# EAGLE design addressing-manual-gnd (EAGLE 7.7.0)
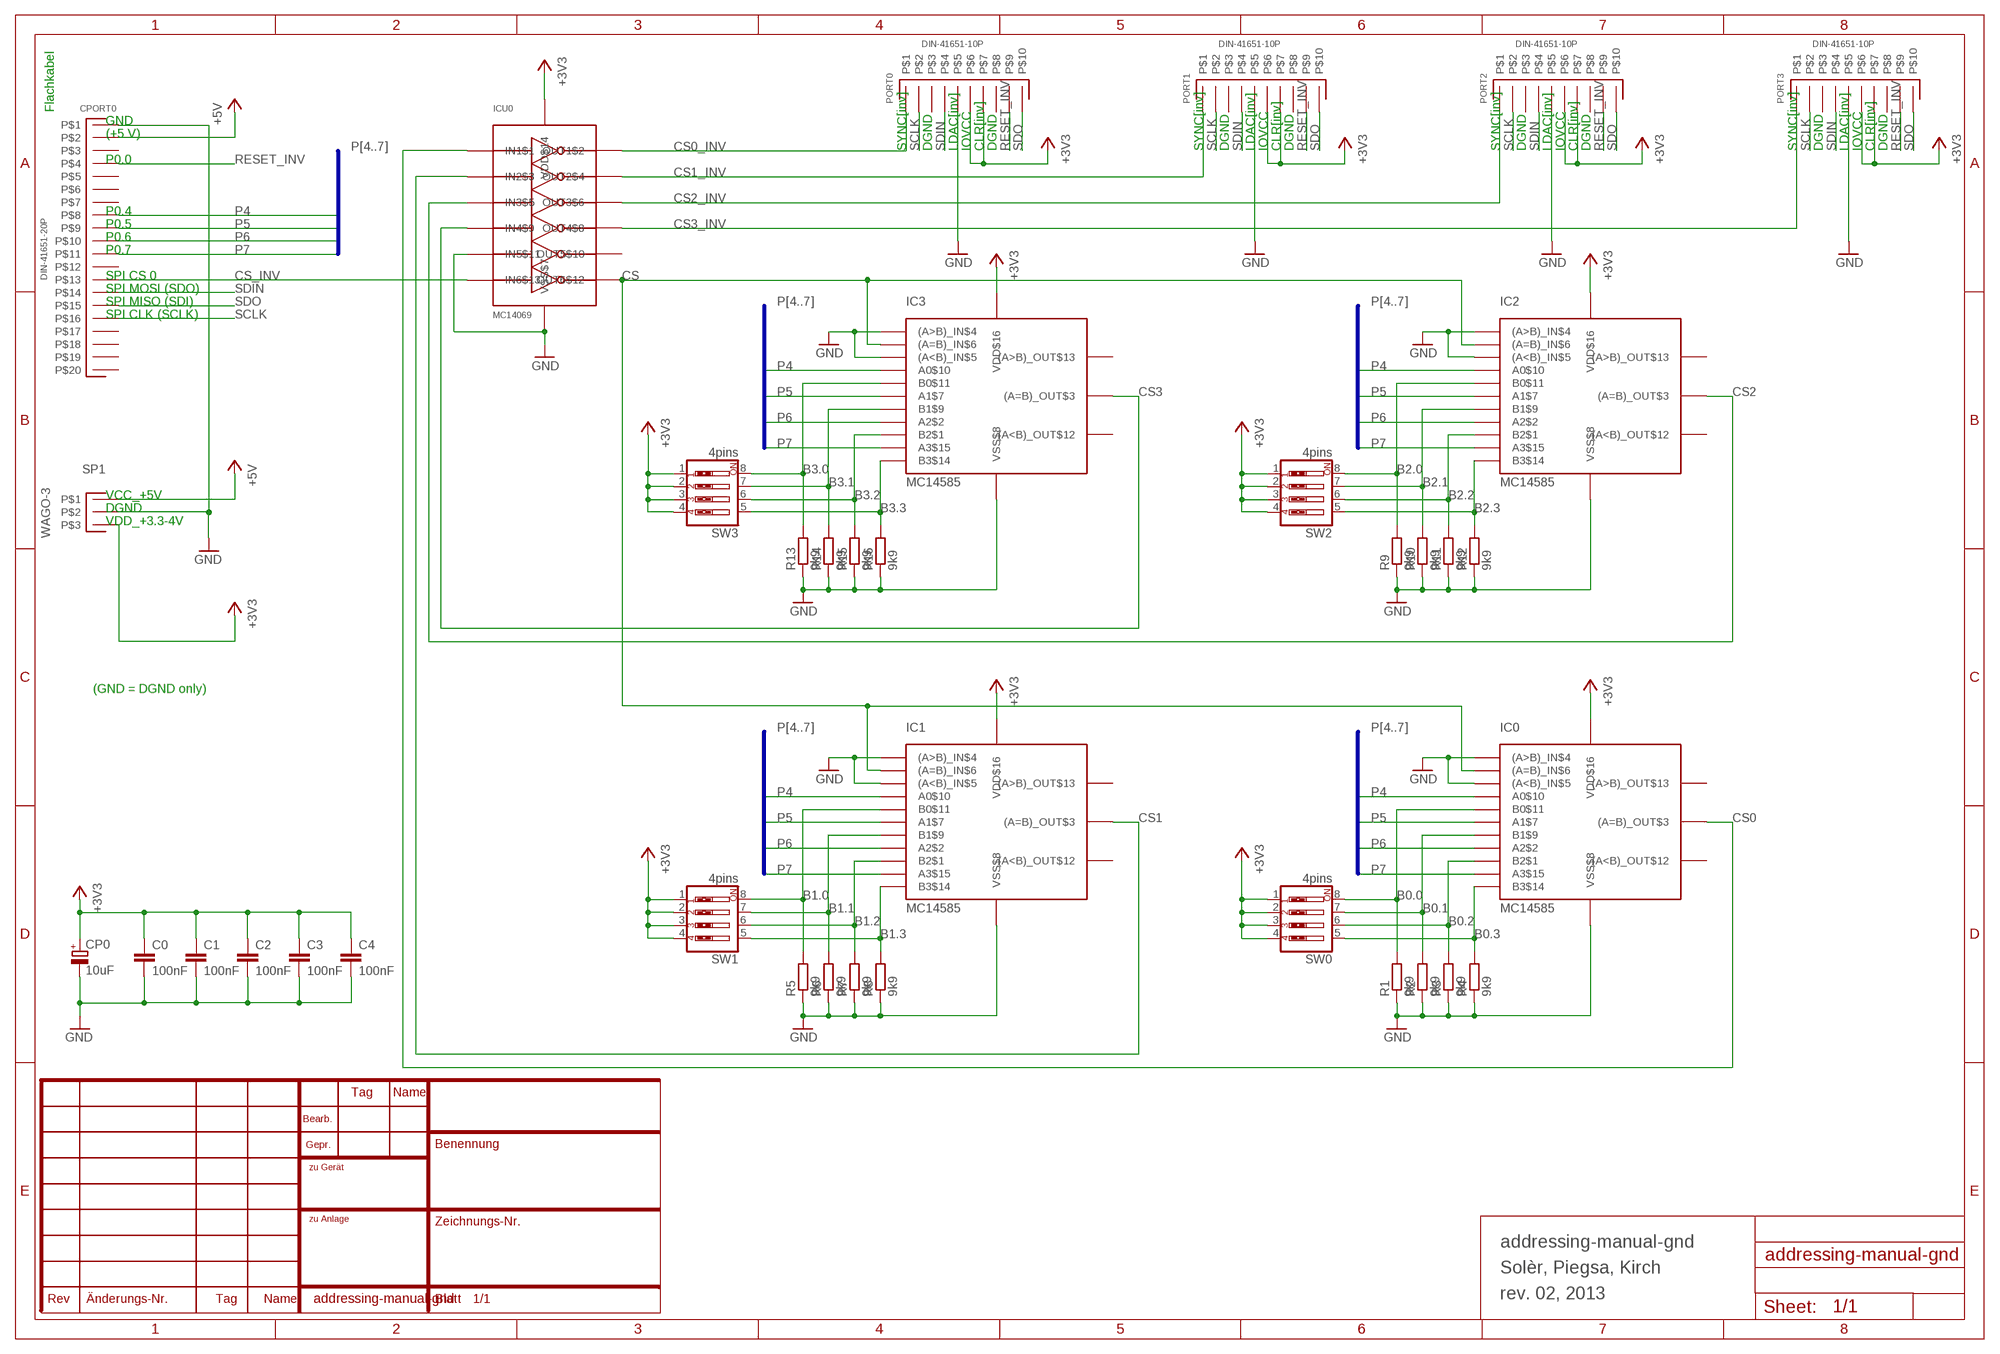
[diagram p0: schematic, sheet 1]

## Parts
C0  100nF  C-EU050-025X075  [C050-025X075]
C1  100nF  C-EU050-025X075  [C050-025X075]
C2  100nF  C-EU050-025X075  [C050-025X075]
C3  100nF  C-EU050-025X075  [C050-025X075]
C4  100nF  C-EU050-025X075  [C050-025X075]
CP0  10uF  CPOL-EUB45181B  [B45181B]
CPORT0  DIN-41651-20P  [DIN-41651-20P]
IC0  MC14585  [PDIP-16]
IC1  MC14585  [PDIP-16]
IC2  MC14585  [PDIP-16]
IC3  MC14585  [PDIP-16]
ICU0  MC14069  [PDIP-14]
PORT0  DIN-41651-10P  [DIN-41651-10P]
PORT1  DIN-41651-10P  [DIN-41651-10P]
PORT2  DIN-41651-10P  [DIN-41651-10P]
PORT3  DIN-41651-10P  [DIN-41651-10P]
R1  9k9  R-EU_0207/12  [0207/12]
R2  9k9  R-EU_0207/12  [0207/12]
R3  9k9  R-EU_0207/12  [0207/12]
R4  9k9  R-EU_0207/12  [0207/12]
R5  9k9  R-EU_0207/12  [0207/12]
R6  9k9  R-EU_0207/12  [0207/12]
R7  9k9  R-EU_0207/12  [0207/12]
R8  9k9  R-EU_0207/12  [0207/12]
R9  9k9  R-EU_0207/12  [0207/12]
R10  9k9  R-EU_0207/12  [0207/12]
R11  9k9  R-EU_0207/12  [0207/12]
R12  9k9  R-EU_0207/12  [0207/12]
R13  9k9  R-EU_0207/12  [0207/12]
R14  9k9  R-EU_0207/12  [0207/12]
R15  9k9  R-EU_0207/12  [0207/12]
R16  9k9  R-EU_0207/12  [0207/12]
SP1  WAGO-3  [WAGO-3]
SW0  4pins  SW_DIP-4  [EDG-04]
SW1  4pins  SW_DIP-4  [EDG-04]
SW2  4pins  SW_DIP-4  [EDG-04]
SW3  4pins  SW_DIP-4  [EDG-04]

## Nets
+3V3: C0.1 C1.1 C2.1 C3.1 C4.1 CP0.+ IC0.VDD$16 IC1.VDD$16 IC2.VDD$16 IC3.VDD$16 ICU0.VDD$14 PORT0.P$6 PORT0.P$7 PORT1.P$6 PORT1.P$7 PORT2.P$6 PORT2.P$7 PORT3.P$6 PORT3.P$7 SP1.P$3 SW0.1 SW0.2 SW0.3 SW0.4 SW1.1 SW1.2 SW1.3 SW1.4 SW2.1 SW2.2 SW2.3 SW2.4 SW3.1 SW3.2 SW3.3 SW3.4
+5V: CPORT0.P$2 SP1.P$1
B0.0: IC0.B0$11 R1.2 SW0.8
B0.1: IC0.B1$9 R2.2 SW0.7
B0.2: IC0.B2$1 R3.2 SW0.6
B0.3: IC0.B3$14 R4.2 SW0.5
B1.0: IC1.B0$11 R5.2 SW1.8
B1.1: IC1.B1$9 R6.2 SW1.7
B1.2: IC1.B2$1 R7.2 SW1.6
B1.3: IC1.B3$14 R8.2 SW1.5
B2.0: IC2.B0$11 R9.2 SW2.8
B2.1: IC2.B1$9 R10.2 SW2.7
B2.2: IC2.B2$1 R11.2 SW2.6
B2.3: IC2.B3$14 R12.2 SW2.5
B3.0: IC3.B0$11 R13.2 SW3.8
B3.1: IC3.B1$9 R14.2 SW3.7
B3.2: IC3.B2$1 R15.2 SW3.6
B3.3: IC3.B3$14 R16.2 SW3.5
CS: IC0.(A=B)_IN$6 IC1.(A=B)_IN$6 IC2.(A=B)_IN$6 IC3.(A=B)_IN$6 ICU0.OUT6$12
CS0: IC0.(A=B)_OUT$3 ICU0.IN1$1
CS0_INV: ICU0.OUT1$2 PORT0.P$1
CS1: IC1.(A=B)_OUT$3 ICU0.IN2$3
CS1_INV: ICU0.OUT2$4 PORT1.P$1
CS2: IC2.(A=B)_OUT$3 ICU0.IN3$5
CS2_INV: ICU0.OUT3$6 PORT2.P$1
CS3: IC3.(A=B)_OUT$3 ICU0.IN4$9
CS3_INV: ICU0.OUT4$8 PORT3.P$1
CS_INV: CPORT0.P$13 ICU0.IN6$13
GND: C0.2 C1.2 C2.2 C3.2 C4.2 CP0.- CPORT0.P$1 IC0.(A<B)_IN$5 IC0.(A>B)_IN$4 IC0.VSS$8 IC1.(A<B)_IN$5 IC1.(A>B)_IN$4 IC1.VSS$8 IC2.(A<B)_IN$5 IC2.(A>B)_IN$4 IC2.VSS$8 IC3.(A<B)_IN$5 IC3.(A>B)_IN$4 IC3.VSS$8 ICU0.IN5$11 ICU0.VSS$7 PORT0.P$5 PORT1.P$5 PORT2.P$5 PORT3.P$5 R1.1 R2.1 R3.1 R4.1 R5.1 R6.1 R7.1 R8.1 R9.1 R10.1 R11.1 R12.1 R13.1 R14.1 R15.1 R16.1 SP1.P$2
P4: CPORT0.P$8 IC0.A0$10 IC1.A0$10 IC2.A0$10 IC3.A0$10
P5: CPORT0.P$9 IC0.A1$7 IC1.A1$7 IC2.A1$7 IC3.A1$7
P6: CPORT0.P$10 IC0.A2$2 IC1.A2$2 IC2.A2$2 IC3.A2$2
P7: CPORT0.P$11 IC0.A3$15 IC1.A3$15 IC2.A3$15 IC3.A3$15
RESET_INV: CPORT0.P$4 PORT0.P$9 PORT1.P$9 PORT2.P$9 PORT3.P$9
SCLK: CPORT0.P$16 PORT0.P$2 PORT1.P$2 PORT2.P$2 PORT3.P$2
SDIN: CPORT0.P$14 PORT0.P$4 PORT1.P$4 PORT2.P$4 PORT3.P$4
SDO: CPORT0.P$15 PORT0.P$10 PORT1.P$10 PORT2.P$10 PORT3.P$10
Unconnected: CPORT0.P$3 CPORT0.P$5 CPORT0.P$6 CPORT0.P$7 CPORT0.P$12 CPORT0.P$17 CPORT0.P$18 CPORT0.P$19 CPORT0.P$20 IC0.(A<B)_OUT$12 IC0.(A>B)_OUT$13 IC1.(A<B)_OUT$12 IC1.(A>B)_OUT$13 IC2.(A<B)_OUT$12 IC2.(A>B)_OUT$13 IC3.(A<B)_OUT$12 IC3.(A>B)_OUT$13 ICU0.OUT5$10 PORT0.P$3 PORT0.P$8 PORT1.P$3 PORT1.P$8 PORT2.P$3 PORT2.P$8 PORT3.P$3 PORT3.P$8

## Buses
P[4..7]

## Notes on the sheet
- Flachkabel
- GND
- (+5 V)
- SYNC[inv] | DGND | LDAC[inv] | IOVCC | CLR[inv] | DGND | SYNC[inv] | DGND | LDAC[inv] | IOVCC | CLR[inv] | DGND | SYNC[inv] | DGND | LDAC[inv] | IOVCC | CLR[inv] | DGND | SYNC[inv] | DGND | LDAC[inv] | IOVCC | CLR[inv] | DGND
- P0.0
- P0.4
- P0.5
- P0.6
- P0.7
- SPI CS 0
- SPI MOSI (SDO)
- SPI MISO (SDI)
- SPI CLK (SCLK)
- VCC_+5V
- DGND
- VDD_+3.3-4V
- (GND = DGND only)
- addressing-manual-gnd
- Solèr, Piegsa, Kirch
- rev. 02, 2013

## Library data of the parts
C0 C1-C4 = rcl:C-EU: CAPACITOR, European symbol
CP0 = rcl:CPOL-EU: POLARIZED CAPACITOR, European symbol
CPORT0 = parts:DIN-41651-20P
IC0 IC1-IC3 = parts:MC14585
ICU0 = parts:MC14069
PORT0 PORT1-PORT3 = parts:DIN-41651-10P
R1-R16 = rcl:R-EU_: RESISTOR, European symbol
SP1 = parts:WAGO-3
SW0 SW1-SW3 = special:SW_DIP-4: DIP SWITCH

## Board
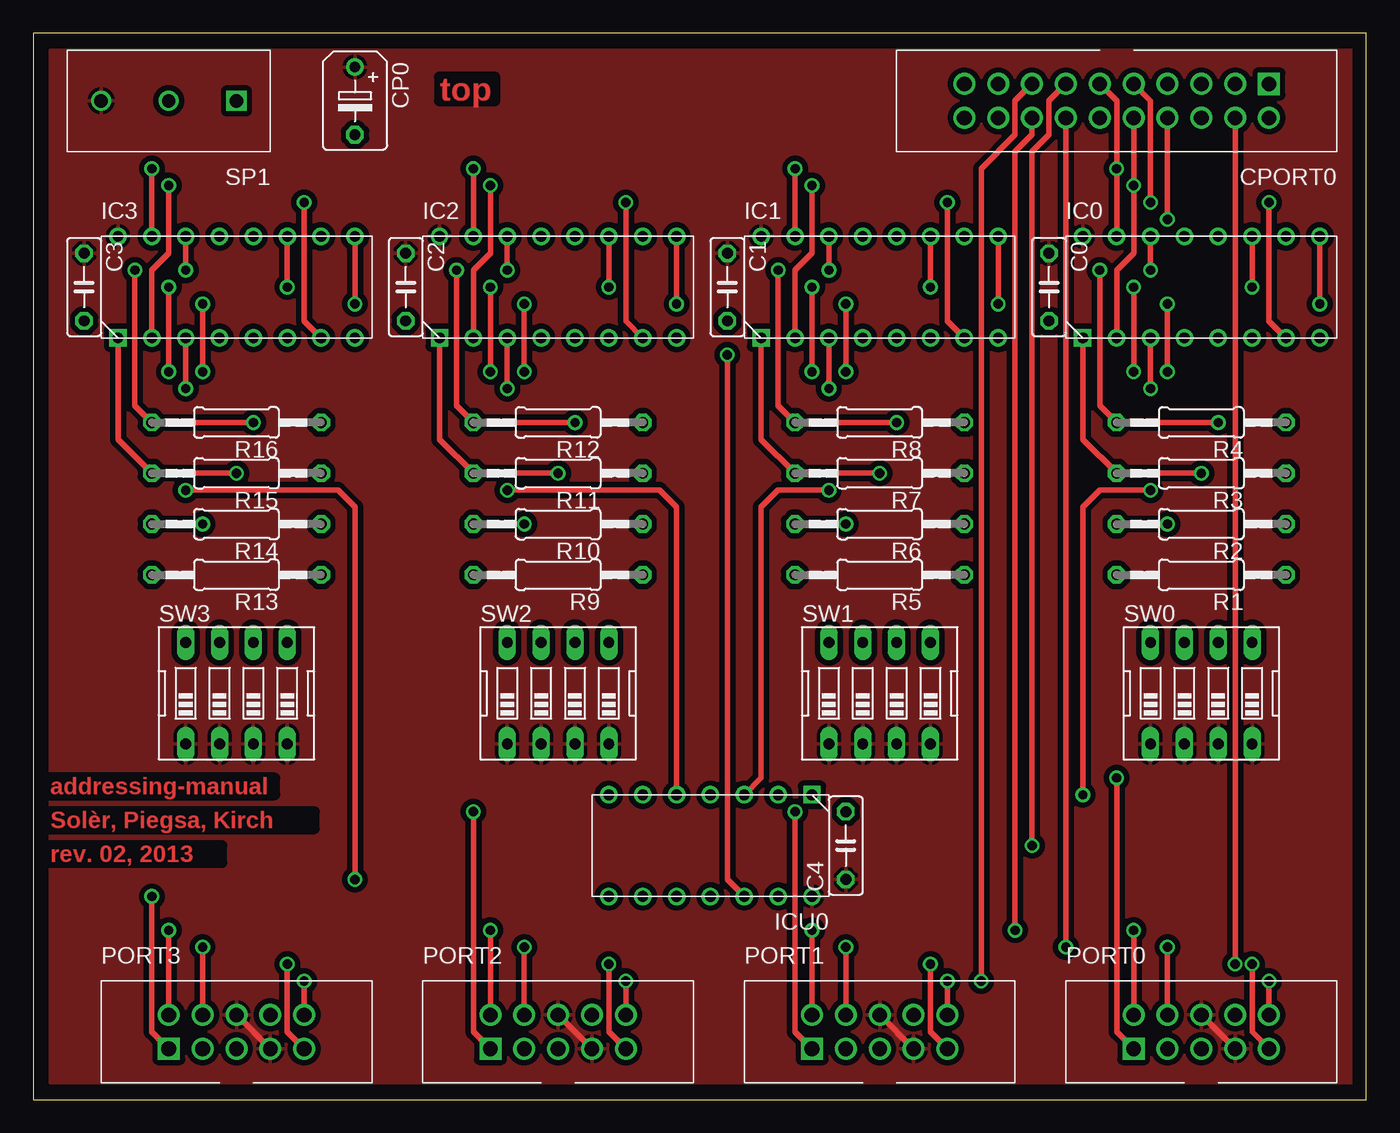
[diagram p1: board, top side]
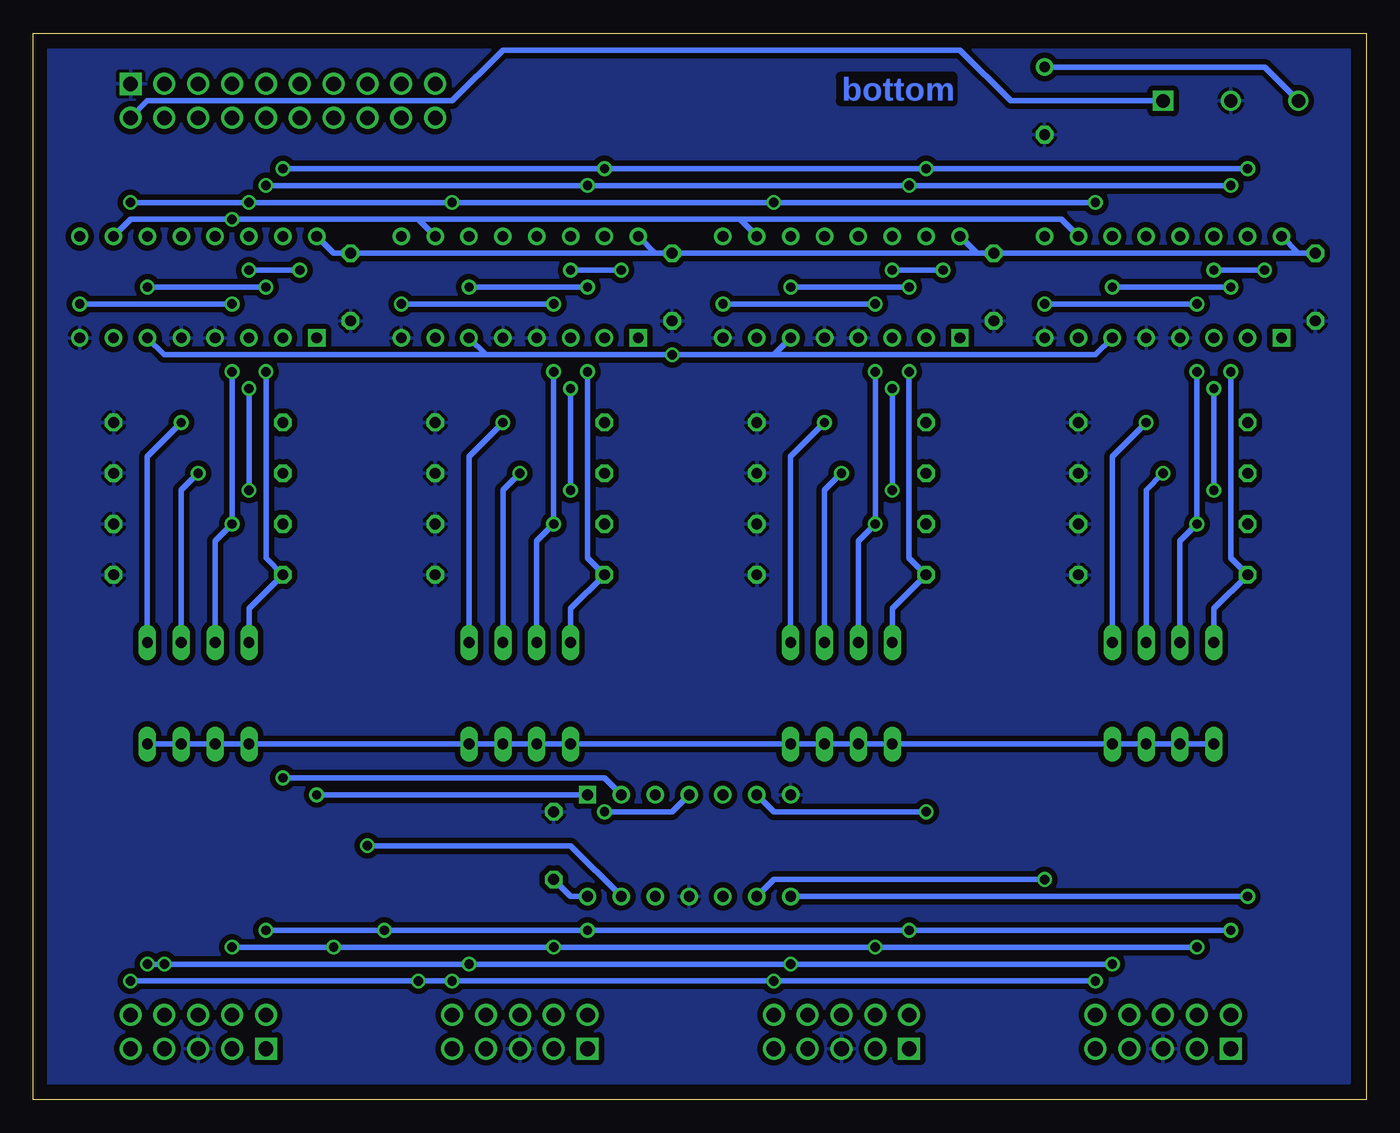
[diagram p2: board, bottom side, seen from below]

Size 100 x 80 mm. Coordinates in mm from the lower left corner, seen from the top.
Outline: 0,0 100,0 100,80 0,80 0,0
Copper layers (1*16): Top 0.035mm / dielectric 1.5mm / Bottom 0.035mm
Design rules "default": minimum track width 10mil, minimum drill 24mil, track to track 8mil, track to pad 8mil, pad to pad 8mil, via to via 8mil, smd to smd 8mil, copper to edge 40mil, drill to drill 8mil, minimum pad ring 10mil, minimum via ring 8mil, stop-mask expansion 4mil, vias tented up to drill 0mil, thermal gap 10mil

### Footprints (pad centres in the part's own frame; a part is rotated, then mirrored left to right if it is on the bottom)
C050-025X075 = drill 0.813 octagon: 1 -2.54,0; 2 2.54,0
B45181B = drill 0.813: + -2.54,0 | drill 0.813 octagon: - 2.54,0
DIN-41651-20P = drill 1.1 square: P$1 -11.43,-1.27 | drill 1.1: P$2 -11.43,1.27; P$3 -8.89,-1.27; P$4 -8.89,1.27; P$5 -6.35,-1.27; P$6 -6.35,1.27; P$7 -3.81,-1.27; P$8 -3.81,1.27; P$9 -1.27,-1.27; P$10 -1.27,1.27; P$11 1.27,-1.27; P$12 1.27,1.27; P$13 3.81,-1.27; P$14 3.81,1.27; P$15 6.35,-1.27; P$16 6.35,1.27; P$17 8.89,-1.27; P$18 8.89,1.27; P$19 11.43,-1.27; P$20 11.43,1.27
PDIP-16 = drill 0.8: (A<B)_IN$5 1.27,-3.81; (A<B)_OUT$12 1.27,3.81; (A=B)_IN$6 3.81,-3.81; (A=B)_OUT$3 -3.81,-3.81; (A>B)_IN$4 -1.27,-3.81; (A>B)_OUT$13 -1.27,3.81; A0$10 6.35,3.81; A1$7 6.35,-3.81; A2$2 -6.35,-3.81; A3$15 -6.35,3.81; B0$11 3.81,3.81; B1$9 8.89,3.81; B3$14 -3.81,3.81; VDD$16 -8.89,3.81; VSS$8 8.89,-3.81 | drill 0.8 square: B2$1 -8.89,-3.81
PDIP-14 = drill 0.8 square: IN1$1 -7.62,-3.81 | drill 0.8: IN2$3 -2.54,-3.81; IN3$5 2.54,-3.81; IN4$9 5.08,3.81; IN5$11 0,3.81; IN6$13 -5.08,3.81; OUT1$2 -5.08,-3.81; OUT2$4 0,-3.81; OUT3$6 5.08,-3.81; OUT4$8 7.62,3.81; OUT5$10 2.54,3.81; OUT6$12 -2.54,3.81; VDD$14 -7.62,3.81; VSS$7 7.62,-3.81
DIN-41651-10P = drill 1.1 square: P$1 -5.08,-1.27 | drill 1.1: P$2 -5.08,1.27; P$3 -2.54,-1.27; P$4 -2.54,1.27; P$5 0,-1.27; P$6 0,1.27; P$7 2.54,-1.27; P$8 2.54,1.27; P$9 5.08,-1.27; P$10 5.08,1.27
0207/12 = drill 0.813 octagon: 1 -6.35,0; 2 6.35,0
WAGO-3 = drill 1 square: P$1 -5.08,0 | drill 1: P$2 0,0; P$3 5.08,0
EDG-04 = drill 0.813 long: 1 -3.81,-3.81; 2 -1.27,-3.81; 3 1.27,-3.81; 4 3.81,-3.81; 5 3.81,3.81; 6 1.27,3.81; 7 -1.27,3.81; 8 -3.81,3.81

### Placement (x,y rotation side)
C0  76.2,60.96 270 top
C1  52.07,60.96 270 top
C2  27.94,60.96 270 top
C3  3.81,60.96 270 top
C4  60.96,19.05 90 top
CP0  24.13,74.93 270 top
CPORT0  81.28,74.93 180 top
IC0  87.63,60.96 0 top
IC1  63.5,60.96 0 top
IC2  39.37,60.96 0 top
IC3  15.24,60.96 0 top
ICU0  50.8,19.05 180 top
PORT0  87.63,5.08 0 top
PORT1  63.5,5.08 0 top
PORT2  39.37,5.08 0 top
PORT3  15.24,5.08 0 top
R1  87.63,39.37 180 top
R2  87.63,43.18 180 top
R3  87.63,46.99 180 top
R4  87.63,50.8 180 top
R5  63.5,39.37 180 top
R6  63.5,43.18 180 top
R7  63.5,46.99 180 top
R8  63.5,50.8 180 top
R9  39.37,39.37 180 top
R10  39.37,43.18 180 top
R11  39.37,46.99 180 top
R12  39.37,50.8 180 top
R13  15.24,39.37 180 top
R14  15.24,43.18 180 top
R15  15.24,46.99 180 top
R16  15.24,50.8 180 top
SP1  10.16,74.93 180 top
SW0  87.63,30.48 0 top
SW1  63.5,30.48 0 top
SW2  39.37,30.48 0 top
SW3  15.24,30.48 0 top

### Tracks (layer width: path | path; a pad name or v marks a point on that pad's centre or on a via)
+3V3
  Top 0.406: PORT3.P$6 PORT3.P$7 | PORT2.P$6 PORT2.P$7 | PORT1.P$6 PORT1.P$7 | PORT0.P$6 PORT0.P$7
  Bottom 0.406: SP1.P$3 7.62,77.47 CP0.+ | SW0.4 SW0.3 SW0.2 SW0.1 SW1.4 SW1.3 SW1.2 SW1.1 SW2.4 SW2.3 SW2.2 SW2.1 SW3.4 SW3.3 SW3.2 SW3.1 | 53.34,63.5 C1.1 C2.1 | 53.34,63.5 C0.1 77.47,63.5 IC0.VDD$16 | ICU0.VDD$14 59.69,15.24 C4.1 | 53.34,63.5 IC1.VDD$16 | C2.1 C3.1 5.08,63.5 IC3.VDD$16 | C2.1 29.21,63.5 IC2.VDD$16
  pour Top (isolate 0.406): 1.27,78.74 99.06,78.74 99.06,1.27 1.27,1.27
+5V
  Bottom 0.406: CPORT0.P$2 91.44,74.93 68.58,74.93 64.77,78.74 30.48,78.74 26.67,74.93 SP1.P$1
B0.0  (via drill 0.7)
  Top 0.406: v91.44,60.96 IC0.B0$11 | v82.55,54.61 v82.55,60.96
  Bottom 0.406: v82.55,54.61 82.55,40.64 R1.2 83.82,36.83 SW0.8 | v82.55,60.96 v91.44,60.96
B0.1  (via drill 0.7)
  Top 0.406: v96.52,59.69 IC0.B1$9 | v85.09,54.61 v85.09,59.69 | v85.09,43.18 R2.2
  Bottom 0.406: v85.09,54.61 v85.09,43.18 86.36,41.91 SW0.7 | v85.09,59.69 v96.52,59.69
B0.2  (via drill 0.7)
  Top 0.406: IC0.B2$1 78.74,49.53 R3.2 v87.63,46.99
  Bottom 0.406: SW0.6 88.9,45.72 v87.63,46.99
B0.3  (via drill 0.7)
  Top 0.406: v83.82,62.23 IC0.B3$14 | v80.01,62.23 80.01,52.07 R4.2 v88.9,50.8
  Bottom 0.406: v80.01,62.23 v83.82,62.23 | SW0.5 91.44,48.26 v88.9,50.8
B1.0  (via drill 0.7)
  Top 0.406: v67.31,60.96 IC1.B0$11 | v58.42,54.61 v58.42,60.96
  Bottom 0.406: v58.42,60.96 v67.31,60.96 | v58.42,54.61 58.42,40.64 R5.2 59.69,36.83 SW1.8
B1.1  (via drill 0.7)
  Top 0.406: v72.39,59.69 IC1.B1$9 | v60.96,54.61 v60.96,59.69 | v60.96,43.18 R6.2
  Bottom 0.406: SW1.7 62.23,41.91 v60.96,43.18 v60.96,54.61 | v60.96,59.69 v72.39,59.69
B1.2  (via drill 0.7)
  Top 0.406: IC1.B2$1 54.61,49.53 R7.2 v63.5,46.99
  Bottom 0.406: SW1.6 64.77,45.72 v63.5,46.99
B1.3  (via drill 0.7)
  Top 0.406: v59.69,62.23 IC1.B3$14 | v64.77,50.8 R8.2 55.88,52.07 v55.88,62.23
  Bottom 0.406: v55.88,62.23 v59.69,62.23 | SW1.5 67.31,48.26 v64.77,50.8
B2.0  (via drill 0.7)
  Top 0.406: v43.18,60.96 IC2.B0$11 | v34.29,54.61 v34.29,60.96
  Bottom 0.406: v34.29,60.96 v43.18,60.96 | v34.29,54.61 34.29,40.64 R9.2 35.56,36.83 SW2.8
B2.1  (via drill 0.7)
  Top 0.406: v48.26,59.69 IC2.B1$9 | v36.83,54.61 v36.83,59.69 | v36.83,43.18 R10.2
  Bottom 0.406: SW2.7 38.1,41.91 v36.83,43.18 v36.83,54.61 | v36.83,59.69 v48.26,59.69
B2.2  (via drill 0.7)
  Top 0.406: IC2.B2$1 30.48,49.53 R11.2 v39.37,46.99
  Bottom 0.406: SW2.6 40.64,45.72 v39.37,46.99
B2.3  (via drill 0.7)
  Top 0.406: v35.56,62.23 IC2.B3$14 | v40.64,50.8 R12.2 31.75,52.07 v31.75,62.23
  Bottom 0.406: v31.75,62.23 v35.56,62.23 | SW2.5 43.18,48.26 v40.64,50.8
B3.0  (via drill 0.7)
  Top 0.406: v19.05,60.96 IC3.B0$11 | v10.16,54.61 v10.16,60.96
  Bottom 0.406: SW3.8 11.43,36.83 R13.2 10.16,40.64 v10.16,54.61 | v10.16,60.96 v19.05,60.96
B3.1  (via drill 0.7)
  Top 0.406: v24.13,59.69 IC3.B1$9 | v12.7,43.18 R14.2 | v12.7,54.61 v12.7,59.69
  Bottom 0.406: SW3.7 13.97,41.91 v12.7,43.18 v12.7,54.61 | v12.7,59.69 v24.13,59.69
B3.2  (via drill 0.7)
  Top 0.406: IC3.B2$1 6.35,49.53 R15.2 v15.24,46.99
  Bottom 0.406: SW3.6 16.51,45.72 v15.24,46.99
B3.3  (via drill 0.7)
  Top 0.406: v11.43,62.23 IC3.B3$14 | v16.51,50.8 R16.2 7.62,52.07 v7.62,62.23
  Bottom 0.406: v7.62,62.23 v11.43,62.23 | SW3.5 19.05,48.26 v16.51,50.8
CS  (via drill 0.7)
  Top 0.406: ICU0.OUT6$12 52.07,16.51 v52.07,55.88
  Bottom 0.406: IC3.(A=B)_IN$6 20.32,55.88 44.45,55.88 | 66.04,55.88 90.17,55.88 IC0.(A=B)_IN$6 | 66.04,55.88 IC1.(A=B)_IN$6 | 44.45,55.88 v52.07,55.88 66.04,55.88 | 44.45,55.88 IC2.(A=B)_IN$6
CS0  (via drill 0.7)
  Top 0.406: v83.82,53.34 IC0.(A=B)_OUT$3 | v83.82,45.72 80.01,45.72 78.74,44.45 v78.74,22.86
  Bottom 0.406: v83.82,45.72 v83.82,53.34 | ICU0.IN1$1 v78.74,22.86
CS0_INV  (via drill 0.7)
  Top 0.406: v81.28,24.13 81.28,5.08 PORT0.P$1
  Bottom 0.406: ICU0.OUT1$2 57.15,24.13 v81.28,24.13
CS1  (via drill 0.7)
  Top 0.406: ICU0.IN2$3 54.61,24.13 54.61,44.45 55.88,45.72 v59.69,45.72 | v59.69,53.34 IC1.(A=B)_OUT$3
  Bottom 0.406: v59.69,45.72 v59.69,53.34
CS1_INV  (via drill 0.7)
  Top 0.406: v57.15,21.59 57.15,5.08 PORT1.P$1
  Bottom 0.406: v57.15,21.59 52.07,21.59 ICU0.OUT2$4
CS2  (via drill 0.7)
  Top 0.406: v35.56,53.34 IC2.(A=B)_OUT$3 | ICU0.IN3$5 48.26,44.45 46.99,45.72 v35.56,45.72
  Bottom 0.406: v35.56,45.72 v35.56,53.34
CS2_INV  (via drill 0.7)
  Top 0.406: PORT2.P$1 33.02,5.08 v33.02,21.59
  Bottom 0.406: v33.02,21.59 44.45,21.59 ICU0.OUT3$6
CS3  (via drill 0.7)
  Top 0.406: 11.43,54.61 v11.43,53.34 IC3.(A=B)_OUT$3 | v11.43,45.72 22.86,45.72 24.13,44.45 v24.13,16.51
  Bottom 0.406: v11.43,45.72 v11.43,53.34 | v24.13,16.51 44.45,16.51 ICU0.IN4$9
CS3_INV  (via drill 0.7)
  Top 0.406: v8.89,15.24 8.89,5.08 PORT3.P$1
  Bottom 0.406: v8.89,15.24 ICU0.OUT4$8
CS_INV  (via drill 0.7)
  Top 0.406: CPORT0.P$13 76.2,74.93 76.2,72.39 74.93,71.12 v74.93,19.05
  Bottom 0.406: ICU0.IN6$13 59.69,19.05 v74.93,19.05
GND
  pour Bottom (isolate 0.406): 1.27,78.74 99.06,78.74 99.06,1.27 1.27,1.27
P4  (via drill 0.7)
  Top 0.406: v85.09,66.04 CPORT0.P$8
  Bottom 0.406: IC0.A0$10 92.71,66.04 v85.09,66.04 71.12,66.04 | 46.99,66.04 22.86,66.04 IC3.A0$10 | 46.99,66.04 71.12,66.04 | 46.99,66.04 IC2.A0$10 | 71.12,66.04 IC1.A0$10
P5  (via drill 0.7)
  Top 0.406: CPORT0.P$9 83.82,74.93 v83.82,67.31 | v92.71,67.31 92.71,58.42 IC0.A1$7 | v20.32,67.31 20.32,58.42 IC3.A1$7 | IC1.A1$7 68.58,58.42 v68.58,67.31 | IC2.A1$7 44.45,58.42 v44.45,67.31
  Bottom 0.406: v92.71,67.31 v83.82,67.31 v68.58,67.31 v44.45,67.31 v20.32,67.31
P6  (via drill 0.7)
  Top 0.406: IC0.A2$2 81.28,62.23 82.55,63.5 v82.55,68.58 CPORT0.P$10 | v58.42,68.58 58.42,63.5 57.15,62.23 IC1.A2$2 | v34.29,68.58 34.29,63.5 33.02,62.23 IC2.A2$2 | v10.16,68.58 10.16,63.5 8.89,62.23 IC3.A2$2
  Bottom 0.406: v82.55,68.58 v58.42,68.58 v34.29,68.58 v10.16,68.58
P7  (via drill 0.7)
  Top 0.406: CPORT0.P$11 81.28,74.93 v81.28,69.85 IC0.A3$15 | v33.02,69.85 IC2.A3$15 | IC3.A3$15 v8.89,69.85 | v57.15,69.85 IC1.A3$15
  Bottom 0.406: v8.89,69.85 v33.02,69.85 v57.15,69.85 v81.28,69.85
RESET_INV  (via drill 0.7)
  Top 0.406: v90.17,10.16 CPORT0.P$4 | v91.44,10.16 91.44,5.08 PORT0.P$9 | v67.31,10.16 67.31,5.08 PORT1.P$9 | PORT2.P$9 43.18,5.08 v43.18,10.16 | PORT3.P$9 19.05,5.08 v19.05,10.16
  Bottom 0.406: v91.44,10.16 v90.17,10.16 v67.31,10.16 v43.18,10.16 v19.05,10.16
SCLK  (via drill 0.7)
  Top 0.406: CPORT0.P$16 74.93,72.39 73.66,71.12 v73.66,12.7 | v82.55,12.7 PORT0.P$2 | v34.29,12.7 PORT2.P$2 | PORT3.P$2 v10.16,12.7 | v58.42,12.7 PORT1.P$2
  Bottom 0.406: v82.55,12.7 v73.66,12.7 v58.42,12.7 v34.29,12.7 v10.16,12.7
SDIN  (via drill 0.7)
  Top 0.406: v77.47,11.43 CPORT0.P$14 | v85.09,11.43 PORT0.P$4 | v36.83,11.43 PORT2.P$4 | PORT3.P$4 v12.7,11.43 | v60.96,11.43 PORT1.P$4
  Bottom 0.406: v85.09,11.43 v77.47,11.43 v60.96,11.43 v36.83,11.43 v12.7,11.43
SDO  (via drill 0.7)
  Top 0.406: CPORT0.P$15 73.66,74.93 73.66,72.39 71.12,69.85 v71.12,8.89 | v92.71,8.89 PORT0.P$10 | v68.58,8.89 PORT1.P$10 | v44.45,8.89 PORT2.P$10 | PORT3.P$10 v20.32,8.89
  Bottom 0.406: v92.71,8.89 v71.12,8.89 v68.58,8.89 v44.45,8.89 v20.32,8.89

### Text on the board
Top: top | addressing-manual | Solèr, Piegsa, Kirch | rev. 02, 2013
Bottom: bottom